# Altium schematic sheet ADC.SchDoc
size Tabloid; SheetNumber: 6; SheetTotal: 6
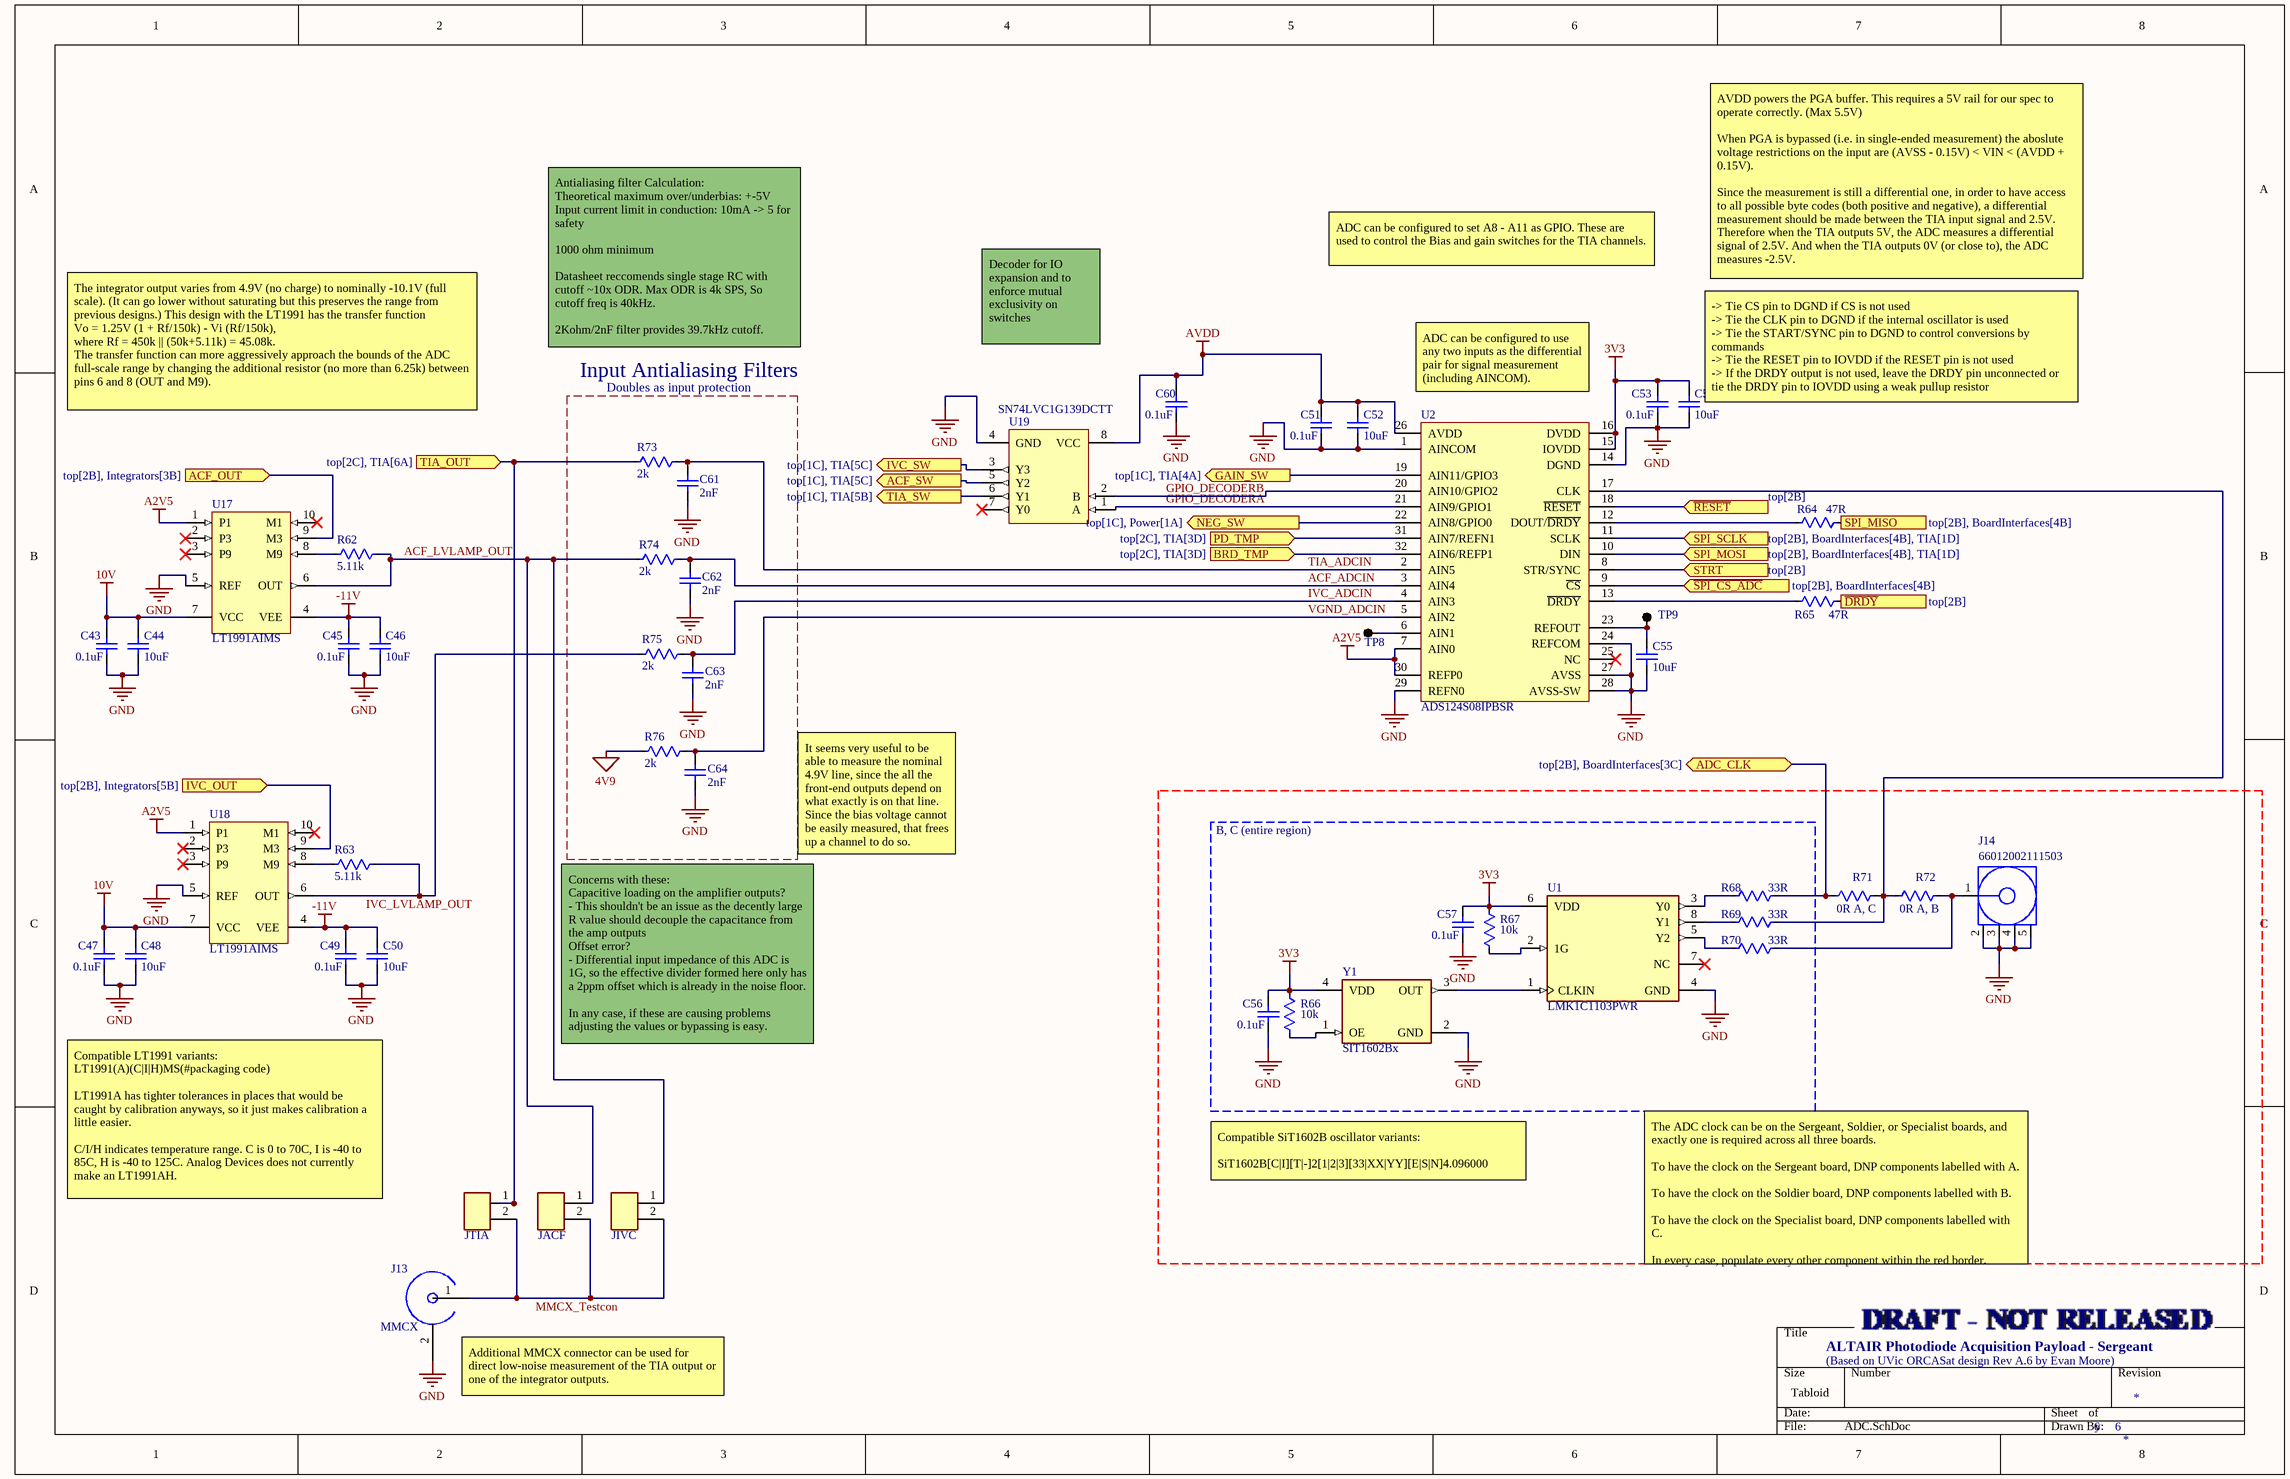
[diagram p0: ADC.SchDoc]

## Parts
C43  0.1uF  [CAP 0603 NON-IPC KEMET X7R]
C44  10uF  [CAP 0805 IPC MID DENSITY]
C45  0.1uF  [CAP 0603 NON-IPC KEMET X7R]
C46  10uF  [CAP 0805 IPC MID DENSITY]
C47  0.1uF  [CAP 0603 NON-IPC KEMET X7R]
C48  10uF  [CAP 0805 IPC MID DENSITY]
C49  0.1uF  [CAP 0603 NON-IPC KEMET X7R]
C50  10uF  [CAP 0805 IPC MID DENSITY]
C51  0.1uF  [CAP 0603 IPC MID DENSITY]
C52  10uF  [CAP 0805 IPC MID DENSITY]
C53  0.1uF  [CAP 0603 IPC MID DENSITY]
C54  10uF  [CAP 0805 IPC MID DENSITY]
C55  10uF  [CAP 0805 IPC MID DENSITY]
C56  0.1uF  [CAP 0603 IPC MID DENSITY]
C57  0.1uF  [CAP 0603 IPC MID DENSITY]
C60  0.1uF  [CAP 0603 IPC MID DENSITY]
C61  2nF  [CAP 0603 IPC MID DENSITY]
C62  2nF  [CAP 0603 IPC MID DENSITY]
C63  2nF  [CAP 0603 IPC MID DENSITY]
C64  2nF  [CAP 0603 IPC MID DENSITY]
J13  MMCX  [COAX MMCX SMD]
J14  66012002111503  [COAX MMCX THT]
JACF  JACF  [JUMPER 2POS 1MM PITCH THT]  (value not drawn)
JIVC  JIVC  [JUMPER 2POS 1MM PITCH THT]  (value not drawn)
JTIA  JTIA  [JUMPER 2POS 1MM PITCH THT]  (value not drawn)
R62  5.11k  [RES 0402 IPC MID DENSITY]
R63  5.11k  [RES 0402 IPC MID DENSITY]
R64  47R  [RES 0402 NON-IPC SEI]
R65  47R  [RES 0402 NON-IPC SEI]
R66  10k  [RES 0603 IPC MID DENSITY]
R67  10k  [RES 0603 IPC MID DENSITY]
R68  33R  [RES 0402 NON-IPC YAGEO]
R69  33R  [RES 0402 NON-IPC YAGEO]
R70  33R  [RES 0402 NON-IPC YAGEO]
R71  0R A, C  [RES 0402 IPC MID DENSITY]
R72  0R A, B  [RES 0402 IPC MID DENSITY]
R73  2k  [RES 0402 IPC MID DENSITY]
R74  2k  [RES 0402 IPC MID DENSITY]
R75  2k  [RES 0402 IPC MID DENSITY]
R76  2k  [RES 0402 IPC MID DENSITY]
TP8  Testpoint  [TESTPOINT THT]  (value not drawn)  (no BOM)
TP9  Testpoint  [TESTPOINT THT]  (value not drawn)  (no BOM)
U1  LMK1C1103PWR  [8-TSSOP 0.65MM PITCH 4.4MM WIDTH IPC MID DENSITY]
U2  ADS124S08IPBSR  [32TQFP 7X7MM IPC LOW DENSITY]
U17  LT1991AIMS  [10-SOP 0.5MM PITCH 3MM WIDTH IPC HIGH DENSITY]
U18  LT1991AIMS  [10-SOP 0.5MM PITCH 3MM WIDTH IPC HIGH DENSITY]
U19  SN74LVC1G139DCTT  [DCT0008A_L]
Y1  SIT1602Bx  [4PQFN NON-IPC SITIME]

## Blocks framed on the sheet
Input Antialiasing Filters: C61-C64 R73-R76
B, C (entire region): C56 C57 R66-R70 U1 Y1

## Ports
ACF_OUT (in, see top[2B], Integrators[3B]), ACF_SW (out, see top[1C], TIA[5C]), ADC_CLK (bidir, see top[2B], BoardInterfaces[3C]), BRD_TMP (in, see top[2C], TIA[3D]), GAIN_SW (out, see top[1C], TIA[4A]), IVC_OUT (in, see top[2B], Integrators[5B]), IVC_SW (out, see top[1C], TIA[5C]), NEG_SW (out, see top[1C], Power[1A]), PD_TMP (in, see top[2C], TIA[3D]), SPI_MISO (out, see top[2B], BoardInterfaces[4B]), SPI_MOSI (in, see top[2B], BoardInterfaces[4B], TIA[1D]), SPI_SCLK (in, see top[2B], BoardInterfaces[4B], TIA[1D]), STRT (in, see top[2B]), TIA_OUT (in, see top[2C], TIA[6A]), TIA_SW (out, see top[1C], TIA[5B]), ~{DRDY} (out, see top[2B]), ~{RESET} (in, see top[2B]), ~{SPI_CS_ADC} (in, see top[2B], BoardInterfaces[4B])

## Nets
3V3: C53.2 C54.2 C56.2 C57.2 R66.2 R67.2 U1.6(VDD) U2.15(IOVDD) U2.16(DVDD) Y1.4(VDD)
4V9: R76.1
10V: C43.2 C44.2 C47.2 C48.2 U17.7(VCC) U18.7(VCC)
-11V: C45.2 C46.2 C49.2 C50.2 U17.4(VEE) U18.4(VEE)
A2V5: U2.7(AIN0) U2.30(REFP0) U17.1(P1) U18.1(P1)
AVDD: C51.2 C52.2 C60.2 U2.26(AVDD) U19.8(VCC)
GND: C43.1 C44.1 C45.1 C46.1 C47.1 C48.1 C49.1 C50.1 C51.1 C52.1 C53.1 C54.1 C55.1 C56.1 C57.1 C60.1 C61.1 C62.1 C63.1 C64.1 J13.2 J14.2(GND) J14.3(GND) J14.4(GND) J14.5(GND) U1.4(GND) U2.1(AINCOM) U2.14(DGND) U2.24(REFCOM) U2.27(AVSS) U2.28(AVSS-SW) U2.29(REFN0) U17.5(REF) U18.5(REF) U19.4(GND) Y1.2(GND)
~{DRDY}: R65.2 ; port ~{DRDY}
~{RESET}: U2.18(~{RESET}) ; port ~{RESET}
~{SPI_CS_ADC}: U2.9(~{CS}) ; port ~{SPI_CS_ADC}
ACF_ADCIN: C62.2 R74.2 U2.3(AIN4)
ACF_LVLAMP_OUT: JACF.1 JIVC.1 R62.2 R74.1 U17.6(OUT)
ACF_OUT: U17.9(M3) ; port ACF_OUT
ACF_SW: U19.5(Y2) ; port ACF_SW
ADC_CLK: R68.1 R71.2 ; port ADC_CLK
BRD_TMP: U2.32(AIN6/REFP1) ; port BRD_TMP
GAIN_SW: U2.19(AIN11/GPIO3) ; port GAIN_SW
GPIO_DECODERA: U2.21(AIN9/GPIO1) U19.1(A)
GPIO_DECODERB: U2.20(AIN10/GPIO2) U19.2(B)
IVC_ADCIN: C63.2 R75.2 U2.4(AIN3)
IVC_LVLAMP_OUT: R63.2 R75.1 U18.6(OUT)
IVC_OUT: U18.9(M3) ; port IVC_OUT
IVC_SW: U19.3(Y3) ; port IVC_SW
MMCX_Testcon: J13.1 JACF.2 JIVC.2 JTIA.2
NEG_SW: U2.22(AIN8/GPIO0) ; port NEG_SW
PD_TMP: U2.31(AIN7/REFN1) ; port PD_TMP
SPI_MISO: R64.2 ; port SPI_MISO
SPI_MOSI: U2.10(DIN) ; port SPI_MOSI
SPI_SCLK: U2.11(SCLK) ; port SPI_SCLK
STRT: U2.8(STR/SYNC) ; port STRT
TIA_ADCIN: C61.2 R73.2 U2.2(AIN5)
TIA_OUT: JTIA.1 R73.1 ; port TIA_OUT
TIA_SW: U19.6(Y1) ; port TIA_SW
VGND_ADCIN: C64.2 R76.2 U2.5(AIN2)
NetC55_2: C55.2 TP9.1 U2.23(REFOUT)
NetJ14_1: J14.1(Signal) R70.1 R72.1
NetR62_1: R62.1 U17.8(M9)
NetR63_1: R63.1 U18.8(M9)
NetR64_1: R64.1 U2.12(DOUT/~{DRDY})
NetR65_1: R65.1 U2.13(~{DRDY})
NetR66_1: R66.1 Y1.1(OE)
NetR67_1: R67.1 U1.2(1G)
NetR68_2: R68.2 U1.3(Y0)
NetR69_1: R69.1 R71.1 R72.2 U2.17(CLK)
NetR69_2: R69.2 U1.8(Y1)
NetR70_2: R70.2 U1.5(Y2)
NetTP8_1: TP8.1 U2.6(AIN1)
NetU1_1: U1.1(CLKIN) Y1.3(OUT)

Not connected (* = marked no-connect by the designer): U1 7(NC)*; U2 25(NC)*; U17 2(P3)* 3(P9)* 10(M1)*; U18 2(P3)* 3(P9)* 10(M1)*; U19 7(Y0)*

## Notes on the sheet
- ADC can be configured to set A8 - A11 as GPIO. These are used to control the Bias and gain switches for the TIA channels.
- AVDD powers the PGA buffer. This requires a 5V rail for our spec to operate correctly. (Max 5.5V)
  When PGA is bypassed (i.e. in single-ended measurement) the aboslute voltage restrictions on the input are (AVSS - 0.15V) < VIN < (AVDD + 0.15V).
  Since the measurement is still a differential one, in order to have access to all possible byte codes (both positive and negative), a differential measurement should be made between the TIA input signal and 2.5V. Therefore when the TIA outputs 5V, the ADC measures a differential signal of 2.5V. And when the TIA outputs 0V (or close to), the ADC measures -2.5V.
- Antialiasing filter Calculation:
  Theoretical maximum over/underbias: +-5V
  Input current limit in conduction: 10mA -> 5 for safety
  1000 ohm minimum
  Datasheet reccomends single stage RC with cutoff ~10x ODR. Max ODR is 4k SPS, So cutoff freq is 40kHz.
  2Kohm/2nF filter provides 39.7kHz cutoff.
- Decoder for IO expansion and to enforce mutual exclusivity on switches
- The integrator output varies from 4.9V (no charge) to nominally -10.1V (full scale). (It can go lower without saturating but this preserves the range from previous designs.) This design with the LT1991 has the transfer function
  Vo = 1.25V (1 + Rf/150k) - Vi (Rf/150k),
  where Rf = 450k || (50k+5.11k) = 45.08k.
  The transfer function can more aggressively approach the bounds of the ADC full-scale range by changing the additional resistor (no more than 6.25k) between pins 6 and 8 (OUT and M9).
- Doubles as input protection
- ADC can be configured to use any two inputs as the differential pair for signal measurement (including AINCOM).
- (near C54) -> Tie CS pin to DGND if CS is not used
  -> Tie the CLK pin to DGND if the internal oscillator is used
  -> Tie the START/SYNC pin to DGND to control conversions by commands
  -> Tie the RESET pin to IOVDD if the RESET pin is not used
  -> If the DRDY output is not used, leave the DRDY pin unconnected or tie the DRDY pin to IOVDD using a weak pullup resistor
- It seems very useful to be able to measure the nominal 4.9V line, since the all the front-end outputs depend on what exactly is on that line. Since the bias voltage cannot be easily measured, that frees up a channel to do so.
- Concerns with these:
  Capacitive loading on the amplifier outputs?
  - This shouldn't be an issue as the decently large R value should decouple the capacitance from the amp outputs
  Offset error?
  - Differential input impedance of this ADC is 1G, so the effective divider formed here only has a 2ppm offset which is already in the noise floor.
  In any case, if these are causing problems adjusting the values or bypassing is easy.
- Compatible LT1991 variants:
  LT1991(A)(C|I|H)MS(#packaging code)
  LT1991A has tighter tolerances in places that would be caught by calibration anyways, so it just makes calibration a little easier.
  C/I/H indicates temperature range. C is 0 to 70C, I is -40 to 85C, H is -40 to 125C. Analog Devices does not currently make an LT1991AH.
- Compatible SiT1602B oscillator variants:
  SiT1602B[C|I][T|-]2[1|2|3][33|XX|YY][E|S|N]4.096000
- The ADC clock can be on the Sergeant, Soldier, or Specialist boards, and exactly one is required across all three boards.
  To have the clock on the Sergeant board, DNP components labelled with A.
  To have the clock on the Soldier board, DNP components labelled with B.
  To have the clock on the Specialist board, DNP components labelled with C.
  In every case, populate every other component within the red border.
- ALTAIR Photodiode Acquisition Payload - Sergeant
- (Based on UVic ORCASat design Rev A.6 by Evan Moore)
- (near J13) Additional MMCX connector can be used for direct low-noise measurement of the TIA output or one of the integrator outputs.

## Library data of the parts
C43 C45 C47 C49 C51 C53 C56 C57 C60 = CAP: Kemet C0603C104K5RACAUTO - Cap Ceramic 0.1uF 50V X7R 10% 0603 125C Paper T/R; MF: Kemet; MP: C0603C104K5RACAUTO
C44 C46 C48 C50 C52 C54 C55 = CAP: Murata GRM21BR61E106KA73L - Cap Ceramic 10uF 10% 25V X5R 0805; MF: Murata; MP: GRM21BR61E106KA73L
C61-C64 = CAP: Cap, Nonpolar, Any, Must choose footprint manually
J13 = MMCX_recp: Conn MMCX F 50Ohm Solder ST SMD Gold Tray; Manufacturer 1: Molex; Manufacturer Part Number 1: 73391-0070; Body Material: Brass; Connector Type: PCB,SMA,Coaxial; Impedance: 50R; Gender: Female; MP: 0734152061; Dielectric Material: PTFE; Max Frequency: 6GHz; Voltage Rating: 170V; RoHS: Yes; Category: RF / Coaxial Connectors; Stock 1: 31911; Mount: Through Hole; Case/Package: SMA; Insulation Material: Teflon; Body Plating: Gold; Contact Material: Copper; Contact Plating: Gold; Plating: Gold; Termination: Solder; Packaging: Bulk; Package Quantity: 1600; Orientation: Straight; Length: 6.08mm; Depth: 6.08mm; Radiation Hardening: No; Lead Free: Lead Free; Halogen Free: Low Halogen; REACH SVHC: Unknown; ComponentLink1URL: https://datasheet.ciiva.com/30257/448910733910070-rf-coax-nectors-30257114.pdf?src-supplier=Onlinecomponents.com; ComponentLink1Description: https://datasheet.ciiva.com/30257/448910733910070-rf-coax-nectors-30257114.pdf?src-supplier=Onlinecomponents.com; ComponentLink2URL: https://datasheet.ciiva.com/5175/0733910070-rf-coax-connectors-173128-5175036.pdf?src-supplier=Mouser; ComponentLink2Description: https://datasheet.ciiva.com/5175/0733910070-rf-coax-connectors-173128-5175036.pdf?src-supplier=Mouser; ComponentLink3URL: https://datasheet.ciiva.com/15172/getdatasheetpartid-226633-15172901.pdf?src-supplier=Verical; ComponentLink3Description: https://datasheet.ciiva.com/15172/getdatasheetpartid-226633-15172901.pdf?src-supplier=Verical; ComponentLink4URL: https://datasheet.ciiva.com/9419/0733910070-rf-coax-connectors-9419351.pdf?src-supplier=Avnet; ComponentLink4Description: https://datasheet.ciiva.com/9419/0733910070-rf-coax-connectors-9419351.pdf?src-supplier=Avnet; ComponentLink5URL: https://datasheet.ciiva.com/16677/0733910070-rf-coax-connectors-16677276.pdf?src-supplier=Avnet+Europe; ComponentLink5Description: https://datasheet.ciiva.com/16677/0733910070-rf-coax-connectors-16677276.pdf?src-supplier=Avnet+Europe; Supplier 1: Digi-Key; Supplier Part Number 1: WM5560-ND; MF: Molex; Pricing 1: 1=2.42000, 10=2.19800, 25=2.06320, 50=1.97360, 100=1.88390, 250=1.70448, 500=1.56992, 1000=1.34565, 2500=1.25594 (USD); Housing Color: Gold; Min Operating Temperature: -55°C; Max Operating Temperature: 165°C; Fastening Type: Snap; ComponentLink6URL: https://datasheet.ciiva.com/15237/133380734152061-rf-coax-nectors-15237680.pdf?src-supplier=Arrow+Europe; ComponentLink6Description: https://datasheet.ciiva.com/15237/133380734152061-rf-coax-nectors-15237680.pdf?src-supplier=Arrow+Europe; ComponentLink7URL: https://datasheet.ciiva.com/18494/734152061-sd-18494866.pdf?src-supplier=Digi-Key; ComponentLink7Description: https://datasheet.ciiva.com/18494/734152061-sd-18494866.pdf?src-supplier=Digi-Key; ComponentLink8URL: https://datasheet.ciiva.com/3951/128690734152061-rf-coax-nectors-3951867.pdf?src-supplier=Arrow+Electronics; ComponentLink8Description: https://datasheet.ciiva.com/3951/128690734152061-rf-coax-nectors-3951867.pdf?src-supplier=Arrow+Electronics
J14 = CMP-207975-000001-3: Rf Coaxial, Mmcx Jack, 50 Ohm, Pcb Rohs Compliant: Yes |Wurth Elektronik 66012002111503; Insulation Resistance: 1GΩ; Impedance: 50Ω; Insertion Loss (dB): 0.25dB; Number of Contacts: 1; Voltage Rating: 170V; Dielectric Material: PTFE; Min Operating Temperature: -55°C; Connector Type: MMCX; Height: 4.6mm; RoHS: Compliant; Insulation Material: PTFE; Max Operating Temperature: 155°C; Contact Material: Gold, Nickel; MF: Wurth Elektronik; MP: 66012002111503
JACF JIVC JTIA = BC020-02-A-0200-0300-L-G: 2x1 Header THT 1mm Pitch; MF: GCT (GLOBAL CONNECTOR TECHNOLOGY); Datasheet Link: https://gct.co/connector/bc020; MP: BC020-02-A-0200-0300-L-G; Mouser Part Number: 640-BC02002A02300LG; Mouser Price/Stock: https://www.mouser.co.uk/ProductDetail/GCT/BC020-02-A-0200-0300-L-G?qs=KUoIvG%2F9IlakgsojlT9P9w%3D%3D
R62 R63 = RES: Panasonic ERA-2AEB5111X - Res 5.11k 0.1% 1/16W SMD 0402; MF: Panasonic Electronic Components; MP: ERA-2AEB5111X
R64 R65 = RES: Stackpole RMCF0402JT47R0 - Res 47Ohm 5% 0.063W 0402 Thick Film AEC-Q200 compliant; MF: Stackpole Electronics Inc.; MP: RMCF0402JT47R0
R66 R67 = RES: Vishay CRCW060310K0FKEA SMD 0603 10k, CRCW e3 Series, 75V, thick film, 100mW; MF: Vishay Dale; MP: CRCW060310K0FKEA
R68-R70 = RES: Yageo RC0402FR-0733RL - Res 33Ohm 1% 1/16W 0402; MF: YAGEO; MP: RC0402FR-0733RL
R71 R72 = RES: Yageo RC0402JR-070RL - Res 0 Ohms 1/16W SMD 0402; MF: YAGEO; MP: RC0402JR-070RL
R73-R76 = RES: Res, Any, Manually select footprint
U1 = LMK1C1103PWR: LVCMOS CLOCK BUFFER 3-CHANNEL; MF: Texas Instruments; MP: LMK1C1103PWR
U2 = ADS124S08IPBSR: 24BIT ADC Delta-Sigma 4k samples/s PGA V-reference; Interface: SPI; Number of Inputs: 12; Number of Bits: 24; Sampling Rate: 4000S/s; Number of A/D Converters: 1; MF: Texas Instruments; RoHS: No; Category: Analog to Digital Converters (ADCs); Stock 1: 2523; Mount: Surface Mount; Case/Package: LQFP; Number of Pins: 32; Min Operating Temperature: -50°C; Max Operating Temperature: 125°C; Packaging: Tape and Reel; ComponentLink1URL: http://www.ti.com/general/docs/lit/getliterature.tsp?genericPartNumber=ADS124S08&fileType=pdf&src-supplier=Farnell; ComponentLink1Description: http://www.ti.com/general/docs/lit/getliterature.tsp?genericPartNumber=ADS124S08&fileType=pdf&src-supplier=Farnell; ComponentLink2URL: http://www.ti.com/lit/ds/symlink/ads124s06.pdf?src-supplier=Digi-Key; ComponentLink2Description: http://www.ti.com/lit/ds/symlink/ads124s06.pdf?src-supplier=Digi-Key; Supplier 1: Digi-Key; Supplier Part Number 1: 296-45170-1-ND; MP: ADS124S08IPBSR
U17 U18 = LT1991IMS#TRPBF: Programmable Gain Amplifier - Single Channel, Precision, -13 to 14 Gain Selectable Operational Amplifier, 0.56 MHz Typical GBW, 0.12 V/us Typical SR, 2.4 to 40 V, 10-Pin SOP (MS-10), Industial, Pb-Free, Reel; Linear Technology Part Number: LT1991; MF: Linear Technology; Vos (mV) Guaranteed: 0.05; Channels (#): 1; Is (mA) Typical: 0.1; Vs Max (V): 40; Vos (mV) Typical: 0.015; Vs Min (V): 2.4; MP: LT1991AIMS#PBF; GBW (MHz) Typical: 0.56; SR (V/us) Typical: 0.12; ComponentLink1Description: Manufacturer URL; PackageVersion: Rev E; PackageDescription: 10-Lead Plastic MSOP, Body 3 x 3 mm, Pitch 0.5 mm; ComponentLink1URL: http://www.linear.com/; Mounting Technology: Surface Mount; Type: SGA; RoHS: Pb-Free; ComponentLink3URL: http://cds.linear.com/docs/en/packaging/MSOP_10_05-08-1661.pdf; ComponentLink3Description: Package Specification; ComponentLink2Description: Datasheet; DatasheetVersion: Rev. H; ComponentLink2URL: http://cds.linear.com/docs/en/datasheet/1991fh.pdf; Packing: Reel; RevisionNote: URLs updated; PackageReference: LT-MS-10
U19 = CMP-0859-00546-3: 2-Line-to-4-Line Decoder, DCT0008A, SMALL T&R; Manufacturer: Texas Instruments; Input Type: CMOS/TTL; VCC(Max)(V): 5.5; Specialty Logic Family: Decoder/Encoder/Multiplexer; ICC @ Nom Voltage(Max)(mA): 0.01; Schmitt Trigger: No; Technology Family: LVC; Bits(#): 1; Output Drive (IOL/IOH)(Max)(mA): 32/-32; Output Type: CMOS; Rating: Catalog; Voltage(Nom)(V): 1.8,2.5,3.3,5; F @ Nom Voltage(Max)(Mhz): 150; VCC(Min)(V): 1.65; tpd @ Nom Voltage(Max)(ns): 16.5,7.5,4.9,3.6; Logic: True; DatasheetVersion: SCES602C; Sub-Family: Decoder/Encoder/Multiplexer; 3-State Output: No; PackageReference: DCT0008A; Generic Part Number: SN74LVC1G139; Operating Temperature Range(C): -40 to 85
Y1 = SIT1602Bx: MEMS OSC XO 4.096MHZ H/LVCMOS; Max Supply Current: 4.5mA; MF: SiTime; MP: SiT1602BC-21-XXN-4.096000; RoHS Compliant: Yes; Width: 0.098inch; Height: 0.032inch; Mount: Surface Mount; Series: SIT1602; Case/Package: SMD/SMT